# Altium project NFC_BusinessCard.PrjPcb
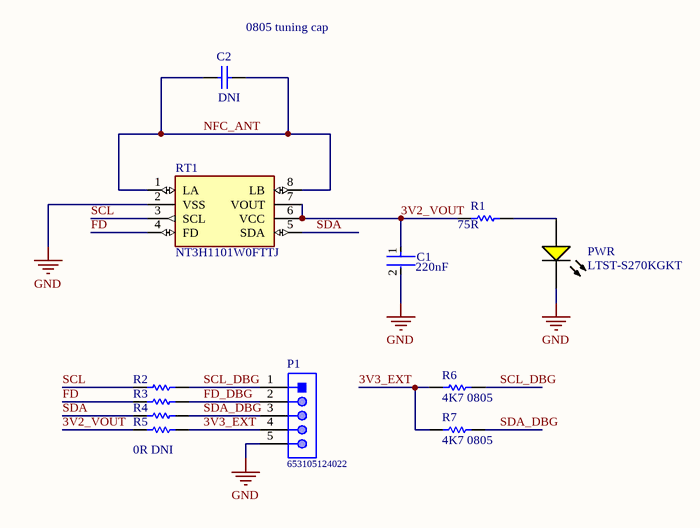
[diagram p0: NFC.SchDoc]
1 sheet, 12 parts. Net scope: global (net labels, ports and power ports of the same name join across sheets).
Board file: NFC.PcbDoc

## Sheet NFC.SchDoc
size Letter; SheetNumber: 1; SheetTotal: 1

### Parts
C1  220nF  [FP-CC0805-0_85-MFG]
C2  DNI  [CAPC2013X140X50ML20T25]
P1  653105124022  [653105124022]
PWR  LTST-S270KGKT  [AVAG-HSMX-C190_V]
R1  75R  [RESC2013X50X30LL20T20]
R2  0R DNI  [RESC2013X60X35ML10T20]
R3  RC0805JR-070RL  [RESC2013X60X35ML10T20]  (value not drawn)
R4  RC0805JR-070RL  [RESC2013X60X35ML10T20]  (value not drawn)
R5  RC0805JR-070RL  [RESC2013X60X35ML10T20]  (value not drawn)
R6  4K7 0805  [YAGO-RC0805_M]
R7  4K7 0805  [YAGO-RC0805_M]
RT1  NT3H1101W0FTTJ  [SOP65P490X110-8N]

### Nets
GND: C1.2 P1.5 PWR.2(K) RT1.2(VSS)
3V2_VOUT: C1.1 R1.1 R5.1 RT1.6(VCC) RT1.7(VOUT)
3V3_EXT: P1.4 R5.2 R6.1 R7.1
FD: R3.1 RT1.4(FD)
FD_DBG: P1.2 R3.2
NFC_ANT: C2.1 C2.2 RT1.1(LA) RT1.8(LB)
SCL: R2.1 RT1.3(SCL)
SCL_DBG: P1.1 R2.2 R6.2
SDA: R4.1 RT1.5(SDA)
SDA_DBG: P1.3 R4.2 R7.2
NetPWR_1: PWR.1(A) R1.2

### Notes on the sheet
- (near C2) 0805 tuning cap

### Library data of the parts
C1 = CMP-03422-000685-1: CAP CER 0.22UF 16V X7R 0805; Manufacturer: Yageo; Manufacturer Part Number: CC0805KRX7R7BB224; Tolerance: 0.1; Material: Ceramic; Device Class L2: Capacitors; Temperature Range Low: -30°C; Device Class L3: Ceramic Capacitors; Digikey Description: CAP CER 0.22UF 16V X7R 0805; Temperature Range High: +85°C; Temperature Characteristic: X7R; Temperature: -30°C to +85°C; Device Class L1: Passive Components; Category: Cap; Footprint Url: http://www.yageo.com/exep/pages/download/literatures/UPY-C_GEN_24.pdf; Voltage Rating: 16 V; Octopart: https://octopart.com/cc0805krx7r7bb224-yageo-8376564; Height: 0.95mm; ComponentLink2Description: Datasheet; Ipc Land Pattern Name: CAPC200125X85; Capacitance: 220 nF; RoHS: TRUE; Lead Free: Yes; Value: 220 nF; Mouser Description: Multilayer Ceramic Capacitors MLCC - SMD/SMT 220nF 16V X7R 10%; Package: CC0805-0.85; ComponentLink2URL: http://www.yageo.com/documents/recent/UPY-GPHC_Y5V_6.3V-to-50V_8.pdf; Automotive: No
C2 = CMP-2007-04534-1: Manufacturer: AVX Interconnect / Elco; Part Number: 08051A1R0CAT2A
P1 = CMP-1502-00760-1: Male Shrouded Header WR-WTB, SMT, Vertical, pitch 1.25 mm, 1 x 5 position; Manufacturer: Wurth Elektronik; Position: 1x5; Contact Resistance: 20mOhm; Pitch: 1.25mm; Working Voltage: 125VAC; Manufacturer URL: http://www.we-online.de; Publisher: WurthElektronik; Orientation: Vertical; Datasheet URL: https://katalog.we-online.de/em/datasheet/6531xx124022.pdf; Package Reference: 653105124022; Part Number: 653105124022; Mounting Technology: SMT; Operating Temperature: -40to85degC; Gender: Male; Packaging: TapeandReel
PWR = CMP-1744-00003-1: LED Uni-Color Yellow, 65 mW, 20 mA, -40 to 85 degC, 2-Pin SMD, RoHS, Tape and Reel; Tolerance: 1%; Voltage Rating: 50 V; Power Rating: 100 mW; Case\Package: 0603; Resistance: 390 Ohm; Min Operating Temperature: -55 degC; Length: 1.6 mm; ComponentLink3Description: Package Specification; Mount: Surface Mount; PackageReference: HSMX-C190; ComponentLink2Description: Datasheet; DatasheetVersion: Mar-12; Case Code (Metric): 1608; Pins: 2; Package Quantity: 5000; ComponentLink2URL: http://docs.avagotech.com/docs/AV02-0551EN; ComponentLink1Description: Manufacturer URL; RoHSCompliant: true; Packaging: Tape and Reel; PackageDescription: 2-Pin Surface Mount Device, Body 1.6 x 0.8 mm, Height 0.9 mm; REACH SVHC: No SVHC; ComponentLink3URL: http://www.fairchildsemi.com/dwg/MA/MA03D.pdf; Voltage Rating (DC): 50 V; Width: 0.8 mm; ComponentLink1URL: http://www.avagotech.com/; Max Operating Temperature: 155 degC; Case Code (Imperial): 0603; Height: 0.45 mm
R1 = CMP-2001-04896-1: Manufacturer: Vishay Dale; Part Number: CRCW08050000Z0EA
R2-R5 = CMP-2100-03673-1: Chip Resistor, 0 Ohm, Jumper, +/- 5%, 0.125 W, -55 to 155 degC, 0805 (2012 Metric), RoHS, Tape and Reel; Manufacturer: Yageo; Power Rating: 125mW; Resistance: 0mOhm; Voltage Rating (DC): 150V; Temperature Coefficient: 200ppm/degreesC; Height: 0.5mm; Depth: 1.25mm; Case Code (Imperial): 0805; Lead Free: LeadFree; Military Standard: Not; Package Description: 2-Pin Surface Mounted Device, Body 2 x 1.25 mm; Case Code (Metric): 2012; Composition: ThickFilm; Voltage Rating: 150V; Manufacturer URL: http://www.yageo.com/; Packaging: TapeandReel; Package Reference: 0805; REACH SVHC: Unknown; Tolerance: 5%; Case/Package: 0805; Max Operating Temperature: 155degC; Number of Pins: 2; Min Operating Temperature: -55degC; RoHSCompliant: true; Length: 2mm; Datasheet URL: http://www.yageo.com/NewPortal/yageodocoutput?fileName=/pdf/R-Chip/PYu-RC_Group_51_RoHS_L_5.pdf; Termination: SMD/SMT; Radiation Hardening: No; Width: 1.25mm; Contact Plating: Tin; Datasheet Version: Rev. 5, 10/2016
R6 R7 = CMP-1568-00001-1: General Puprose Chip Resistor, 4700 Ohm +/- 1%, 0.125 W, -55 to 155 degC, 2-Pin SMD, RoHS, Tape and Reel; PartNumber: RC0805FR-074K7L; Tolerance: +/- 1%; Power: 0.125 W; PackageDescription: 2-Pin Surface Mount Device, Body 2 x 1.25 mm; ComponentLink2URL: http://www.yageo.com/documents/recent/PYu-RC_Group_51_RoHS_L-3.pdf; Temperature Min: -55 degC; Packing: Tape and Reel; Mounting Technology: Surface Mount; ComponentLink1URL: http://www.yageo.com/NewPortal/_en/index.jsp; Resistance: 4700 Ohm; Temperature Max: 155 degC; ComponentLink2Description: Datasheet; DatasheetVersion: Rev. 3; RoHS: TRUE; ComponentLink1Description: Manufacturer URL
RT1 = NT3H1101W0FTTJ: Thermistor; Manufacturer_Name: NXP; Datasheet Link: https://ms.componentsearchengine.com/Datasheets/2/NT3H1101W0FTTJ.pdf; Height: 1.1mm; Manufacturer_Part_Number: NT3H1101W0FTTJ; Mouser Part Number: 771-NT3H1101W0FTTJ; Mouser Price/Stock: https://www.mouser.co.uk/ProductDetail/NXP-Semiconductors/NT3H1101W0FTTJ?qs=d7b8vw%252BBfo2DKYkZh36fFg%3D%3D; Arrow Part Number: NT3H1101W0FTTJ; Arrow Price/Stock: https://www.arrow.com/en/products/nt3h1101w0fttj/nxp-semiconductors?region=nac